# EAGLE design Cool (EAGLE 9.6.2)
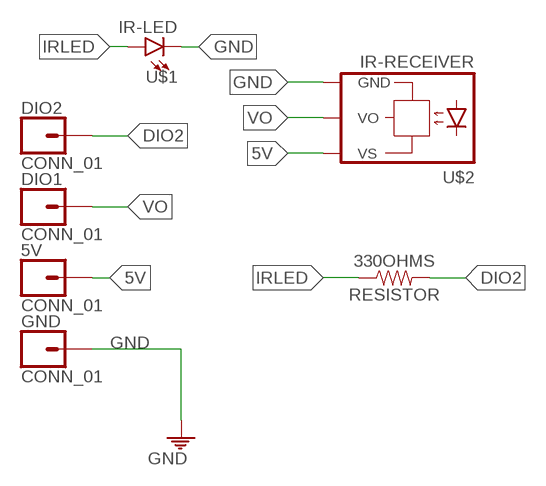
[diagram p0: schematic, sheet 1]

## Parts
5V  CONN_01  [1X01]
330OHMS  RESISTOR  [AXIAL-0.3]
DIO1  CONN_01  [1X01]
DIO2  CONN_01  [1X01]
GND  CONN_01  [1X01]
U$1  IR-LED  [LED_5MM]
U$2  IR-RECEIVER  [TSOP17_TB1]

## Nets
5V: 5V.1 U$2.VS
DIO2: 330OHMS.P$2 DIO2.1
GND: GND.1 U$1.K(C) U$2.GND
IRLED: 330OHMS.P$1 U$1.A
VO: DIO1.1 U$2.VO

## Library data of the parts
5V DIO1 DIO2 GND = ECE5_WS:CONN_01: Header Pin - 1
330OHMS = ECE5_Tutorial:RESISTOR
U$1 = ECE5_Tutorial:IR-LED
U$2 = ECE5_Tutorial:IR-RECEIVER

## Board
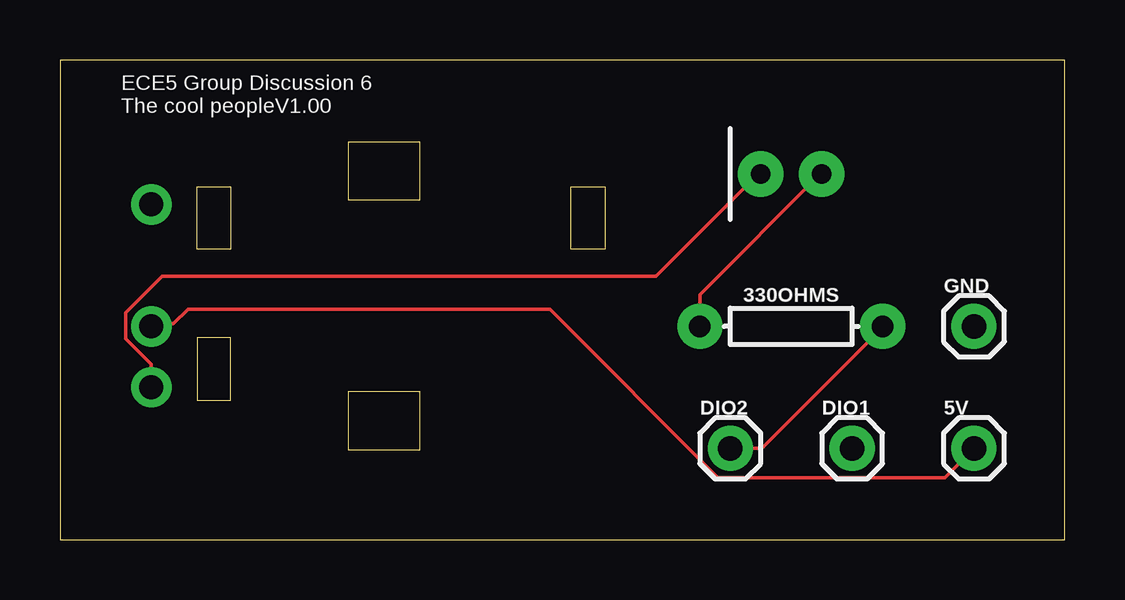
[diagram p1: board, top side]
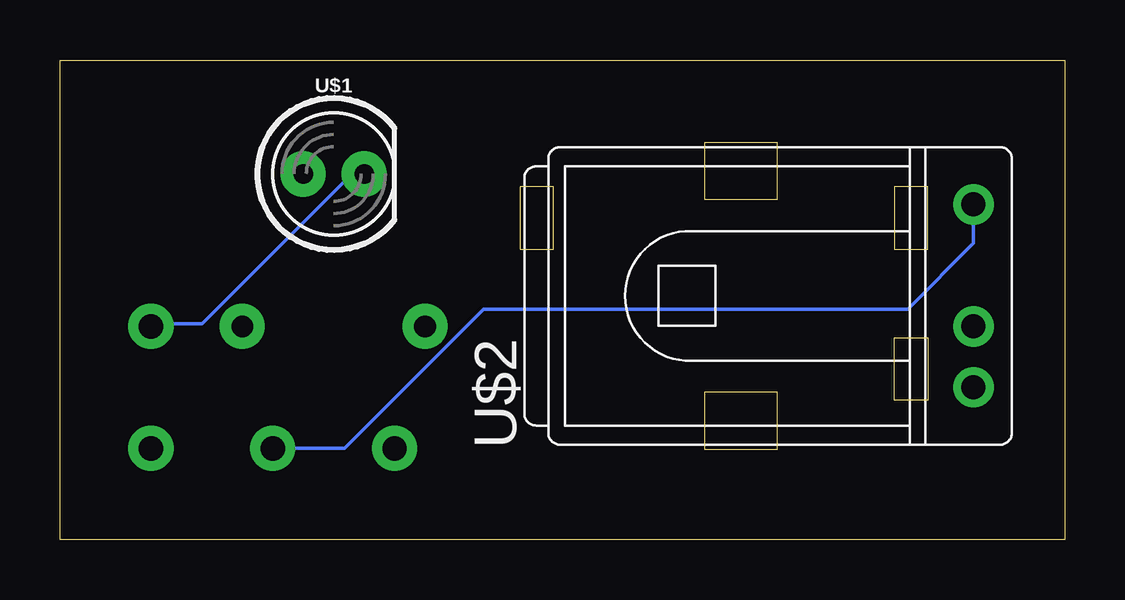
[diagram p2: board, bottom side, seen from below]

Size 41.89 x 19.99 mm. Coordinates in mm from the lower left corner, seen from the top.
Outline: 0,0 41.89,0 41.89,19.99 0,19.99 0,0
Copper layers (1*16): Top 0.035mm / dielectric 1.5mm / Bottom 0.035mm
Design rules "default": minimum track width 6mil, minimum drill 0.35mm, track to track 6mil, track to pad 6mil, pad to pad 6mil, via to via 6mil, smd to smd 6mil, copper to edge 40mil, drill to drill 6mil, minimum pad ring 10mil, minimum via ring 8mil, stop-mask expansion 4mil, vias tented up to drill 0mil, thermal gap 10mil

### Footprints (pad centres in the part's own frame; a part is rotated, then mirrored left to right if it is on the bottom)
1X01 = drill 1.016 pad 1.88: 1 0,0
AXIAL-0.3 = drill 0.9 pad 1.88: P$1 -3.81,0; P$2 3.81,0
LED_5MM = drill 0.813 pad 1.88: A -1.27,0; K 1.27,0
TSOP17_TB1 = drill 1 pad 1.676: GND 0,-3.81; VO 0,3.81; VS 0,-1.27

### Placement (x,y rotation side)
5V  38.1,3.81 0 top
330OHMS  30.48,8.89 0 top
DIO1  33.02,3.81 0 top
DIO2  27.94,3.81 0 top
GND  38.1,8.89 0 top
U$1  30.48,15.24 0 bottom
U$2  3.81,10.16 0 bottom

### Tracks (layer width: path | path; a pad name or v marks a point on that pad's centre or on a via)
5V
  Top 0.152: 5V.1 36.88,2.59 27.43,2.59 20.42,9.6 5.33,9.6 4.72,8.99 3.81,8.99 U$2.VS
DIO2
  Top 0.152: DIO2.1 29.26,3.81 34.29,8.84 330OHMS.P$2
GND
  Top 0.152: U$2.GND 3.81,7.32 2.74,8.38 2.74,9.45 4.27,10.97 24.84,10.97 29.11,15.24 U$1.K
  Bottom 0.152: U$1.K 29.72,15.24 35.97,8.99 38.1,8.99 GND.1
IRLED
  Top 0.152: 330OHMS.P$1 26.67,10.21 31.7,15.24 U$1.A
VO
  Bottom 0.152: U$2.VO 3.81,12.34 6.55,9.6 24.23,9.6 30.02,3.81 DIO1.1

### Text on the board
tPlace: ECE5 Group Discussion 6 / The cool peopleV1.00